# EAGLE design photon_VTspy (EAGLE 9.0.1)
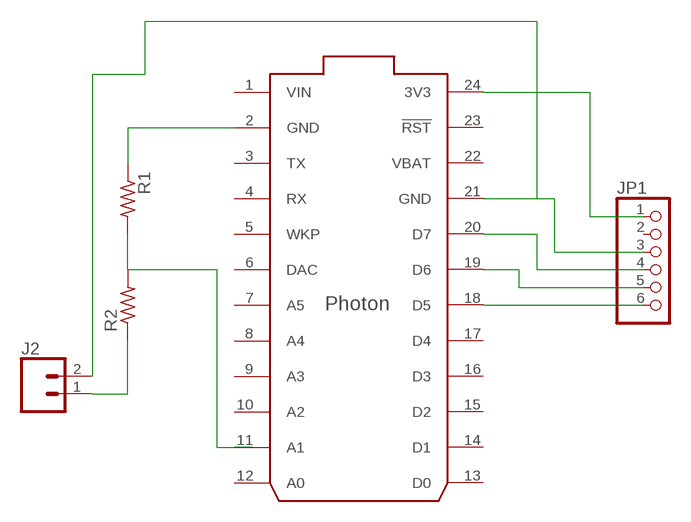
[diagram p0: schematic, sheet 1]

## Parts
J2  CONN_023.5MM  [SCREWTERMINAL-3.5MM-2]
JP1  PINHD-1X6  [1X06]
R1  R-US_0207/10  [0207/10]
R2  R-US_0207/10  [0207/10]
U$1  PHOTON_WITH_HEADERS  [PHOTON]

## Nets
N$1: JP1.1 U$1.24(3V3)
N$3: JP1.4 U$1.20(D7)
N$4: J2.2 JP1.3 U$1.21(GND)
N$5: J2.1 R2.1
N$6: JP1.5 U$1.19(D6)
N$7: JP1.6 U$1.18(D5)
N$8: R1.1 U$1.2(GND)
N$14: R1.2 R2.2 U$1.11(A1)
Unconnected: JP1.2 U$1.3(TX) U$1.4(RX) U$1.5(WKP) U$1.6(DAC) U$1.7(A5) U$1.8(A4) U$1.9(A3) U$1.10(A2) U$1.12(A0) U$1.13(D0) U$1.14(D1) U$1.15(D2) U$1.16(D3) U$1.17(D4) U$1.23(!RST)

## Power pins joined to a net without a drawn wire
VBAT: U$1.22(VBAT)
VIN: U$1.1(VIN)

## Library data of the parts
J2 = SparkFun-Connectors:CONN_02: Multi connection point. Often used as Generic Header-pin footprint for 0.1 inch spaced/style header connections On any of the 0.1 inch spaced packages, you can populate with these: Break Away Headers - Straight <https://www.sparkfun.com/products/116> (PRT-00116) Break Away Male Headers - Right Angle <https://www.sparkfun.com/products/553> (PRT-00553) Female Headers <https://www.sparkfun.com/products/115> (PRT-00115) Break Away Headers - Machine Pin <https://www.sparkfun.com/products/117> (PRT-00117) Break Away Female Headers - Swiss Machine Pin <https://www.sparkfun.com/products/743> (PRT-00743) For SCREWTERMINALS and SPRING TERMINALS visit here: Screw Terimnals on SparkFun.com <https://www.sparkfun.com/search/results?term=Screw+Terminals> (5mm/3.5mm/2.54mm spacing) This device is also useful as a general connection point to wire up your design to another part of your project. Our various solder wires solder well into these plated through hole pads. Hook-Up Wire - Assortment (Stranded, 22 AWG) <https://www.sparkfun.com/products/11375> (PRT-11375) Hook-Up Wire - Assortment (Solid Core, 22 AWG) <https://www.sparkfun.com/products/11367> (PRT-11367) View the entire wire category on our website here <https://www.sparkfun.com/categories/141> Special notes: Molex polarized connector foot print use with: PRT-08233 with associated crimp pins and housings. 2.54_SCREWTERM for use with PRT-10571. 3.5mm Screw Terminal footprints for PRT-08084 5mm Screw Terminal footprints for use with PRT-08432; PROD_ID: CONN-08399
JP1 = adafruit:PINHD-1X6: PIN HEADER
R1 R2 = resistor:R-US_: RESISTOR, American symbol
U$1 = Spark:PHOTON

## Board
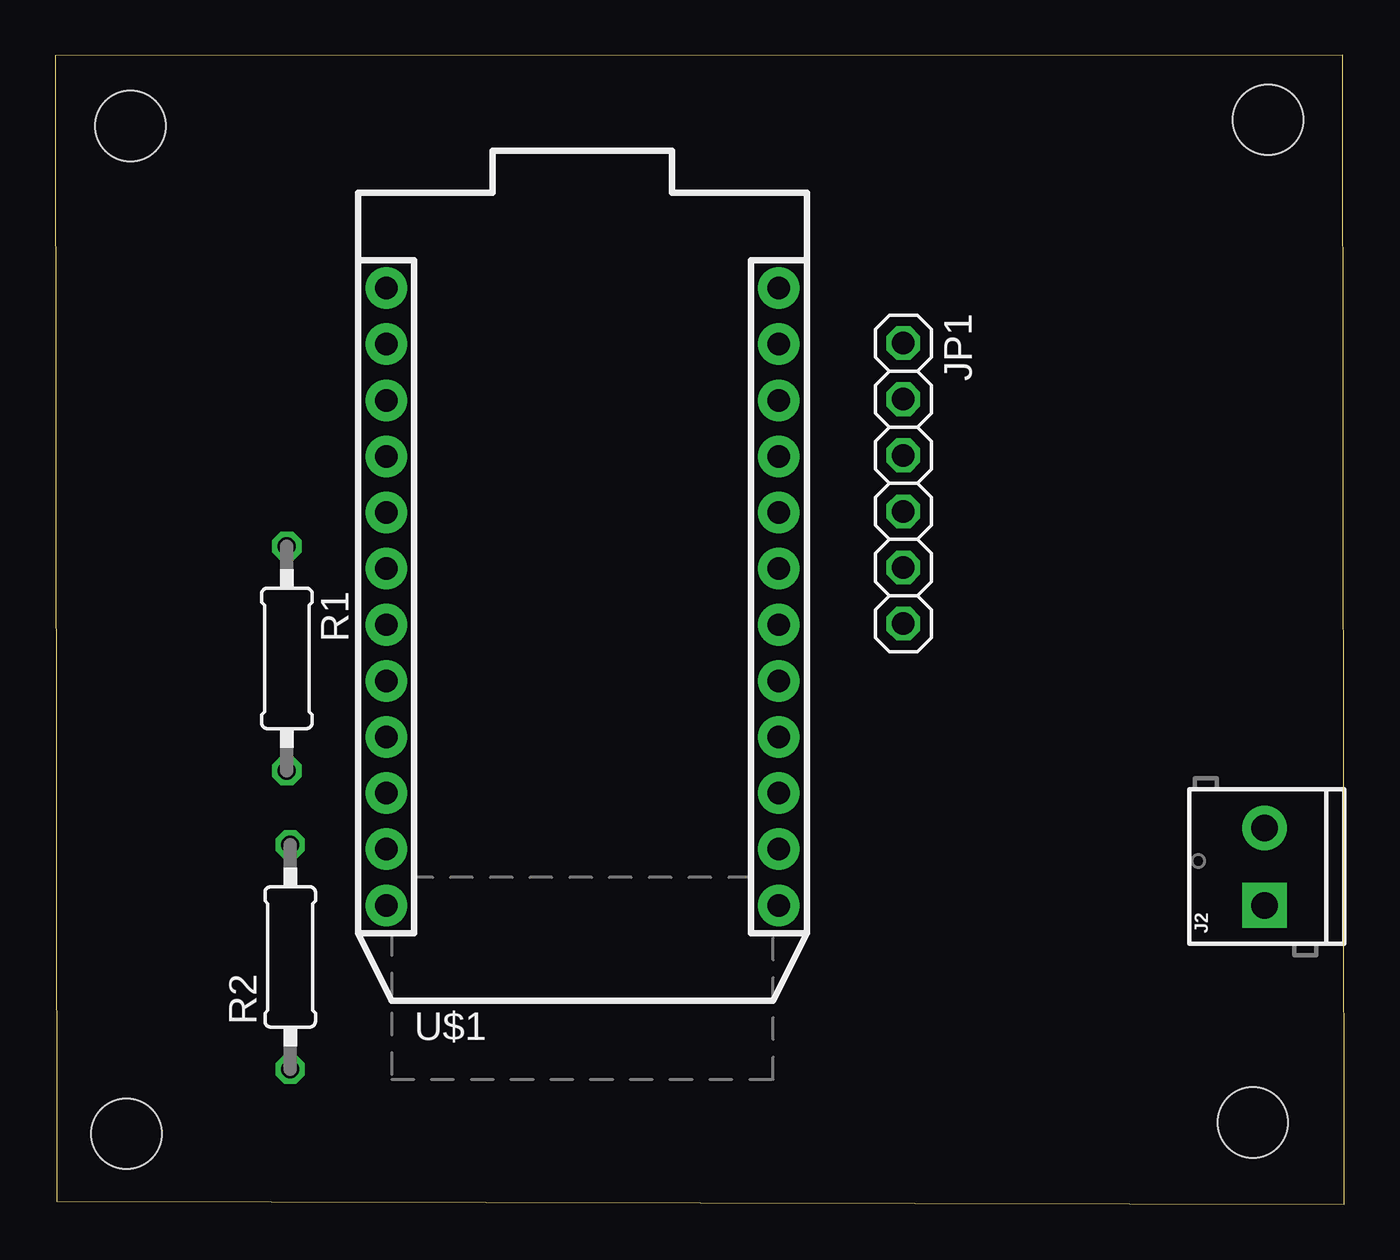
[diagram p1: board, top side]
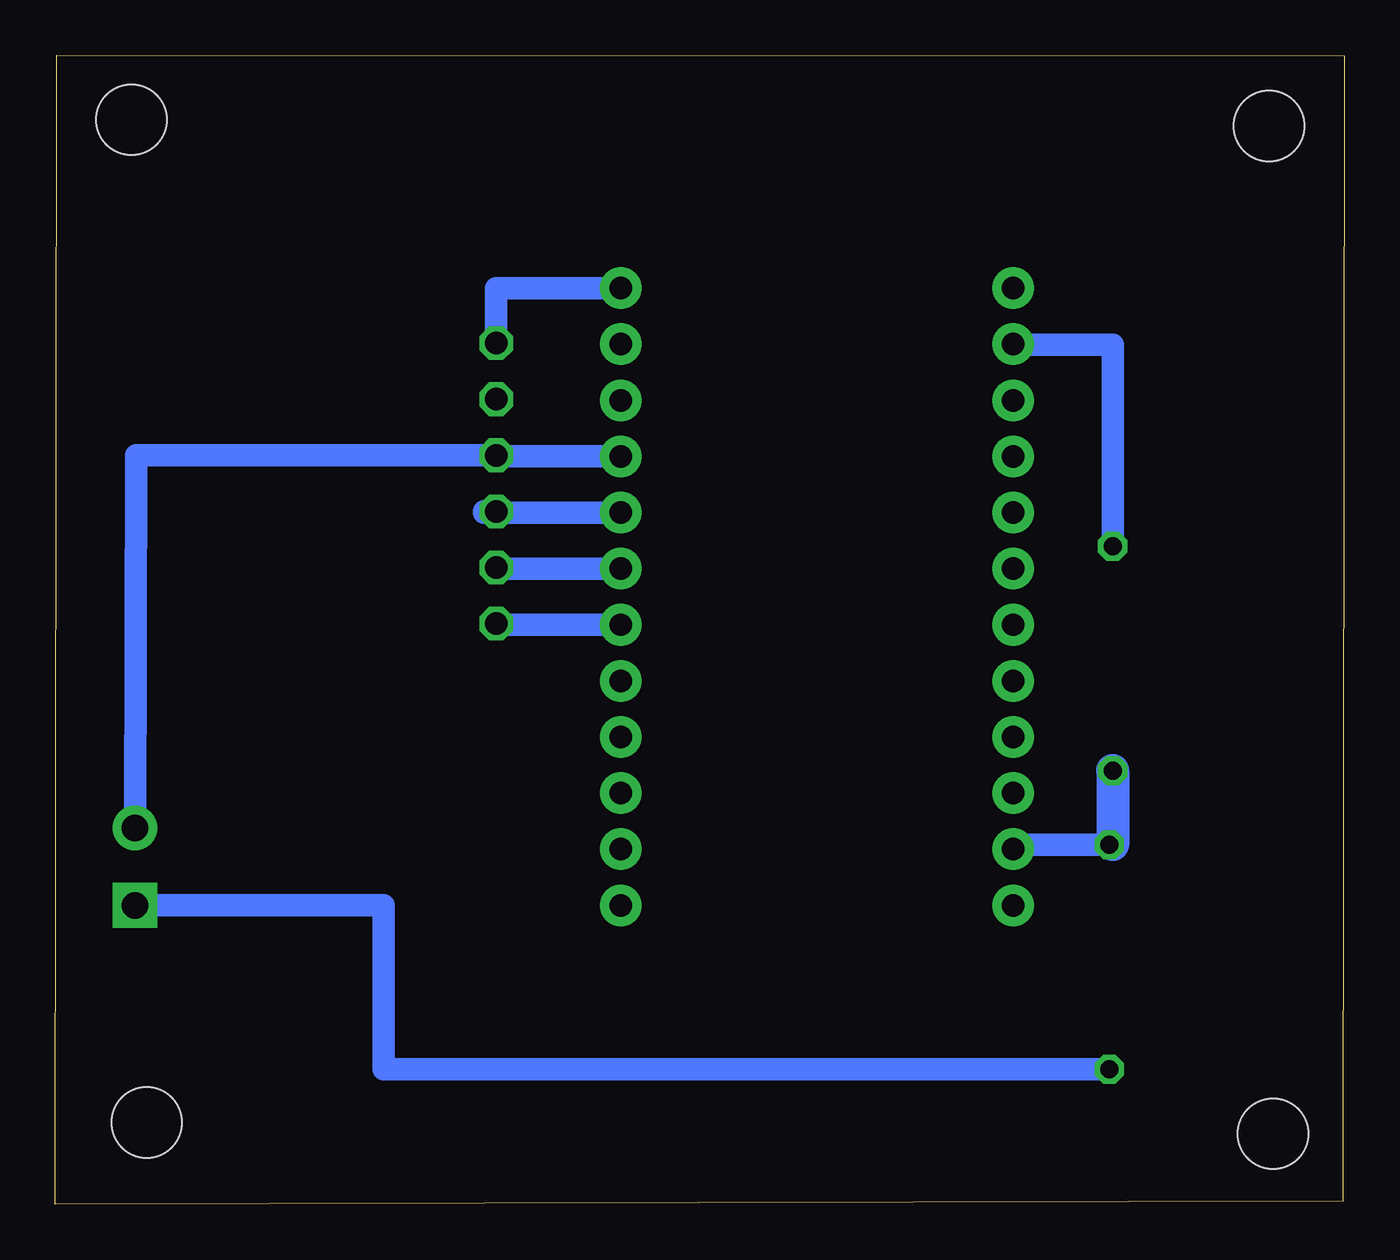
[diagram p2: board, bottom side, seen from below]

Size 58.37 x 52.02 mm. Coordinates in mm from the lower left corner, seen from the top.
Outline: 0.08,0.15 58.37,0 58.3,52.02 0,51.99 0.08,0.15
Copper layers (1*16): Top 0.035mm / dielectric 1.5mm / Bottom 0.035mm
Design rules "default": minimum track width 10mil, minimum drill 24mil, track to track 8mil, track to pad 8mil, pad to pad 8mil, via to via 8mil, smd to smd 8mil, copper to edge 40mil, drill to drill 8mil, minimum pad ring 10mil, minimum via ring 8mil, stop-mask expansion 4mil, vias tented up to drill 0mil, thermal gap 10mil
Holes 3.17 mm at 3.4,48.82 3.23,3.2 54.23,3.71 54.91,49.1

### Footprints (pad centres in the part's own frame; a part is rotated, then mirrored left to right if it is on the bottom)
SCREWTERMINAL-3.5MM-2 = drill 1.2 pad 2.032 square: 1 0,0 | drill 1.2 pad 2.032: 2 3.5,0
1X06 = drill 1.016 octagon: 1 -6.35,0; 2 -3.81,0; 3 -1.27,0; 4 1.27,0; 5 3.81,0; 6 6.35,0
0207/10 = drill 0.813 octagon: 1 -5.08,0; 2 5.08,0
PHOTON = drill 1.016 pad 1.88: 1 1.27,32.258; 2 1.27,29.718; 3 1.27,27.178; 4 1.27,24.638; 5 1.27,22.098; 6 1.27,19.558; 7 1.27,17.018; 8 1.27,14.478; 9 1.27,11.938; 10 1.27,9.398; 11 1.27,6.858; 12 1.27,4.318; 13 19.05,4.318; 14 19.05,6.858; 15 19.05,9.398; 16 19.05,11.938; 17 19.05,14.478; 18 19.05,17.018; 19 19.05,19.558; 20 19.05,22.098; 21 19.05,24.638; 22 19.05,27.178; 23 19.05,29.718; 24 19.05,32.258

### Placement (x,y rotation side)
J2  54.76,13.54 90 top
JP1  38.4,32.64 270 top
R1  10.49,24.71 270 top
R2  10.64,11.2 90 top
U$1  13.72,9.22 0 top

### Tracks (layer width: path | path; a pad name or v marks a point on that pad's centre or on a via)
N$1
  Bottom 1.016: U$1.24 38.4,41.48 JP1.1
N$3
  Bottom 1.016: U$1.20 38.96,31.32 38.96,31.37 JP1.4
N$4
  Bottom 1.016: U$1.21 38.4,33.86 JP1.3 54.71,33.91 J2.2
N$5
  Bottom 1.016: R2.1 43.51,6.12 43.51,13.54 J2.1
N$6
  Bottom 1.016: U$1.19 38.4,28.78 JP1.5
N$7
  Bottom 1.016: U$1.18 38.4,26.24 JP1.6
N$8
  Bottom 1.016: R1.1 10.49,38.91 14.99,38.91 U$1.2
N$14
  Bottom 0.61: 10.49,16.28 R2.2 10.64,16.23
  Bottom 1.016: R2.2 14.99,16.28 U$1.11
  Bottom 1.5: R1.2 10.49,16.28